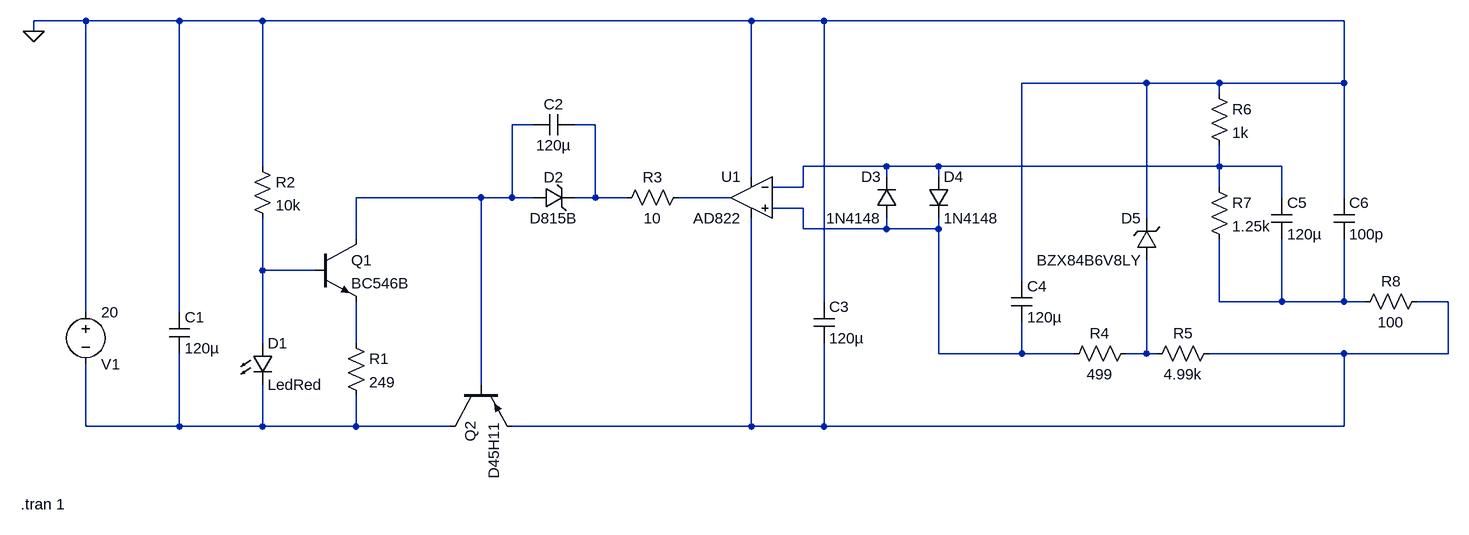
[diagram p0: schematic SuperRegNeg.asc]
SuperRegNeg.asc, the LTspice schematic file:
Version 4
SHEET 1 2164 680
WIRE 64 -320 -16 -320
WIRE 208 -320 64 -320
WIRE 336 -320 208 -320
WIRE 1088 -320 336 -320
WIRE 1200 -320 1088 -320
WIRE 2000 -320 1200 -320
WIRE -16 -304 -16 -320
WIRE 1696 -224 1504 -224
WIRE 1808 -224 1696 -224
WIRE 2000 -224 2000 -320
WIRE 2000 -224 1808 -224
WIRE 1808 -208 1808 -224
WIRE 752 -160 720 -160
WIRE 848 -160 816 -160
WIRE 336 -96 336 -320
WIRE 1296 -96 1168 -96
WIRE 1376 -96 1296 -96
WIRE 1808 -96 1808 -128
WIRE 1808 -96 1376 -96
WIRE 1904 -96 1808 -96
WIRE 1088 -80 1088 -320
WIRE 1296 -80 1296 -96
WIRE 1376 -80 1376 -96
WIRE 1168 -64 1168 -96
WIRE 1168 -64 1120 -64
WIRE 1808 -64 1808 -96
WIRE 672 -48 480 -48
WIRE 720 -48 720 -160
WIRE 720 -48 672 -48
WIRE 752 -48 720 -48
WIRE 848 -48 848 -160
WIRE 848 -48 816 -48
WIRE 896 -48 848 -48
WIRE 1056 -48 976 -48
WIRE 1904 -48 1904 -96
WIRE 2000 -48 2000 -224
WIRE 1168 -32 1120 -32
WIRE 1696 -16 1696 -224
WIRE 1168 0 1168 -32
WIRE 1296 0 1296 -16
WIRE 1296 0 1168 0
WIRE 1376 0 1376 -16
WIRE 1376 0 1296 0
WIRE 480 16 480 -48
WIRE 336 64 336 -16
WIRE 416 64 336 64
WIRE 1504 80 1504 -224
WIRE 1200 112 1200 -320
WIRE 1808 112 1808 16
WIRE 1904 112 1904 16
WIRE 1904 112 1808 112
WIRE 2000 112 2000 16
WIRE 2000 112 1904 112
WIRE 2032 112 2000 112
WIRE 2160 112 2112 112
WIRE 64 128 64 -320
WIRE 208 128 208 -320
WIRE 336 176 336 64
WIRE 480 176 480 112
WIRE 1376 192 1376 0
WIRE 1504 192 1504 144
WIRE 1504 192 1376 192
WIRE 1584 192 1504 192
WIRE 1696 192 1696 48
WIRE 1696 192 1664 192
WIRE 1712 192 1696 192
WIRE 2000 192 1792 192
WIRE 2160 192 2160 112
WIRE 2160 192 2000 192
WIRE 672 240 672 -48
WIRE 64 304 64 208
WIRE 208 304 208 192
WIRE 208 304 64 304
WIRE 336 304 336 240
WIRE 336 304 208 304
WIRE 480 304 480 256
WIRE 480 304 336 304
WIRE 624 304 480 304
WIRE 1088 304 1088 -16
WIRE 1088 304 720 304
WIRE 1200 304 1200 176
WIRE 1200 304 1088 304
WIRE 2000 304 2000 192
WIRE 2000 304 1200 304
FLAG -16 -304 0
SYMBOL voltage 64 112 R0
WINDOW 0 24 96 Left 2
WINDOW 3 24 16 Left 2
WINDOW 123 0 0 Left 0
WINDOW 39 0 0 Left 0
SYMATTR InstName V1
SYMATTR Value 20
SYMBOL cap 192 128 R0
SYMATTR InstName C1
SYMATTR Value 120µ
SYMBOL LED 320 176 R0
SYMATTR InstName D1
SYMATTR Value LedRed
SYMATTR Description Diode
SYMATTR Type diode
SYMBOL res 464 160 R0
SYMATTR InstName R1
SYMATTR Value 249
SYMBOL npn 416 16 R0
SYMATTR InstName Q1
SYMATTR Value BC546B
SYMBOL res 320 -112 R0
SYMATTR InstName R2
SYMATTR Value 10k
SYMBOL pnp 624 240 M90
SYMATTR InstName Q2
SYMATTR Value D45H11
SYMBOL zener 752 -32 R270
WINDOW 0 32 32 VTop 2
WINDOW 3 0 32 VBottom 2
SYMATTR InstName D2
SYMATTR Value D815B
SYMATTR Description Diode
SYMATTR Type diode
SYMBOL cap 816 -176 R90
WINDOW 0 0 32 VBottom 2
WINDOW 3 32 32 VTop 2
SYMATTR InstName C2
SYMATTR Value 120µ
SYMBOL res 992 -64 R90
WINDOW 0 0 56 VBottom 2
WINDOW 3 32 56 VTop 2
SYMATTR InstName R3
SYMATTR Value 10
SYMBOL OpAmps\\AD822 1088 -112 M0
SYMATTR InstName U1
SYMBOL cap 1184 112 R0
SYMATTR InstName C3
SYMATTR Value 120µ
SYMBOL diode 1312 -16 R180
WINDOW 0 24 64 Left 2
WINDOW 3 24 0 Left 2
SYMATTR InstName D3
SYMATTR Value 1N4148
SYMBOL diode 1360 -80 R0
SYMATTR InstName D4
SYMATTR Value 1N4148
SYMBOL cap 1488 80 R0
SYMATTR InstName C4
SYMATTR Value 120µ
SYMBOL res 1680 176 R90
WINDOW 0 0 56 VBottom 2
WINDOW 3 32 56 VTop 2
SYMATTR InstName R4
SYMATTR Value 499
SYMBOL res 1808 176 R90
WINDOW 0 0 56 VBottom 2
WINDOW 3 32 56 VTop 2
SYMATTR InstName R5
SYMATTR Value 4.99k
SYMBOL zener 1712 48 R180
WINDOW 0 24 64 Left 2
WINDOW 3 24 0 Left 2
SYMATTR InstName D5
SYMATTR Value BZX84B6V8LY
SYMATTR Description Diode
SYMATTR Type diode
SYMBOL res 1792 -224 R0
SYMATTR InstName R6
SYMATTR Value 1k
SYMBOL res 1792 -80 R0
SYMATTR InstName R7
SYMATTR Value 1.25k
SYMBOL cap 1888 -48 R0
SYMATTR InstName C5
SYMATTR Value 120µ
SYMBOL cap 1984 -48 R0
SYMATTR InstName C6
SYMATTR Value 100p
SYMBOL res 2128 96 R90
WINDOW 0 0 56 VBottom 2
WINDOW 3 32 56 VTop 2
SYMATTR InstName R8
SYMATTR Value 100
TEXT -36 424 Left 2 !.tran 1

The netlist it stands for:
* SuperRegNeg.asc
V1 0 N011 20
C1 0 N011 120µ
D1 N006 N011 LedRed
R1 N009 N011 249
Q1 N001 N006 N009 0 BC546B
R2 0 N006 10k
Q2 N011 N001 N008 0 D45H11
D2 N001 N002 D815B
C2 N002 N001 120µ
R3 N004 N002 10
XU1 N005 N003 0 N008 N004 AD822  ; pins In+ In- V+ V- OUT
C3 0 N008 120µ
D3 N005 N003 1N4148
D4 N003 N005 1N4148
C4 0 N005 120µ
R4 N010 N005 499
R5 N008 N010 4.99k
D5 N010 0 BZX84B6V8LY
R6 0 N003 1k
R7 N003 N007 1.25k
C5 N003 N007 120µ
C6 0 N007 100p
R8 N008 N007 100
.model D D
.lib standard.dio
.model NPN NPN
.model PNP PNP
.lib standard.bjt
.tran 1
.backanno
.end